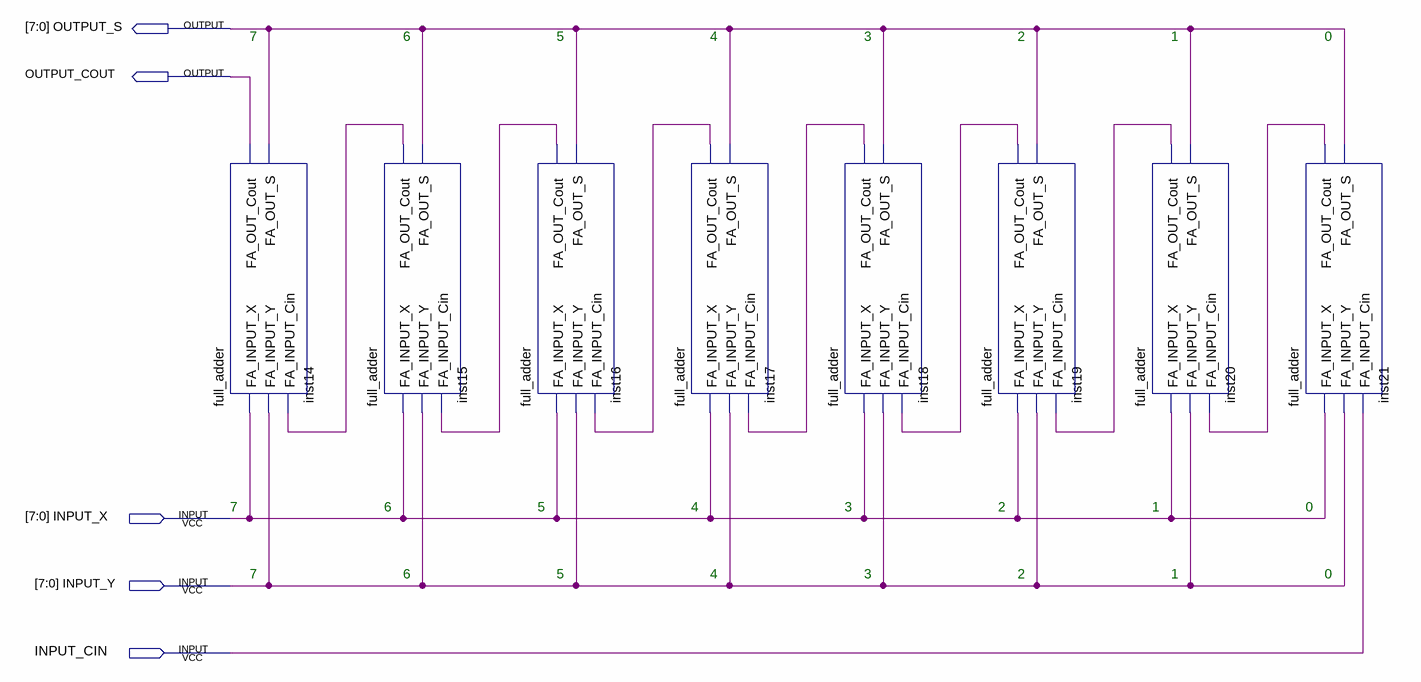
[diagram p0: schematic sheet]
// Quartus schematic rca_8b.bdf as structural Verilog: 8 symbols, 5 pins
module rca_8b (
  input  \[7..0]_INPUT_X ,
  input  \[7..0]_INPUT_Y ,
  input  INPUT_CIN,
  output \[7..0]_OUTPUT_S ,
  output OUTPUT_COUT
);

  wire inst15_fa_out_cout, inst16_fa_out_cout, inst17_fa_out_cout, inst18_fa_out_cout, inst19_fa_out_cout,
       inst20_fa_out_cout, inst21_fa_out_cout;

  full_adder inst14 (
    .FA_INPUT_X(\[7..0]_INPUT_X ), .FA_INPUT_Y(\[7..0]_INPUT_Y ), .FA_INPUT_Cin(inst15_fa_out_cout),
    .FA_OUT_Cout(OUTPUT_COUT), .FA_OUT_S(\[7..0]_OUTPUT_S ));
  full_adder inst15 (
    .FA_INPUT_X(\[7..0]_INPUT_X ), .FA_INPUT_Y(\[7..0]_INPUT_Y ), .FA_INPUT_Cin(inst16_fa_out_cout),
    .FA_OUT_Cout(inst15_fa_out_cout), .FA_OUT_S(\[7..0]_OUTPUT_S ));
  full_adder inst16 (
    .FA_INPUT_X(\[7..0]_INPUT_X ), .FA_INPUT_Y(\[7..0]_INPUT_Y ), .FA_INPUT_Cin(inst17_fa_out_cout),
    .FA_OUT_Cout(inst16_fa_out_cout), .FA_OUT_S(\[7..0]_OUTPUT_S ));
  full_adder inst17 (
    .FA_INPUT_X(\[7..0]_INPUT_X ), .FA_INPUT_Y(\[7..0]_INPUT_Y ), .FA_INPUT_Cin(inst18_fa_out_cout),
    .FA_OUT_Cout(inst17_fa_out_cout), .FA_OUT_S(\[7..0]_OUTPUT_S ));
  full_adder inst18 (
    .FA_INPUT_X(\[7..0]_INPUT_X ), .FA_INPUT_Y(\[7..0]_INPUT_Y ), .FA_INPUT_Cin(inst19_fa_out_cout),
    .FA_OUT_Cout(inst18_fa_out_cout), .FA_OUT_S(\[7..0]_OUTPUT_S ));
  full_adder inst19 (
    .FA_INPUT_X(\[7..0]_INPUT_X ), .FA_INPUT_Y(\[7..0]_INPUT_Y ), .FA_INPUT_Cin(inst20_fa_out_cout),
    .FA_OUT_Cout(inst19_fa_out_cout), .FA_OUT_S(\[7..0]_OUTPUT_S ));
  full_adder inst20 (
    .FA_INPUT_X(\[7..0]_INPUT_X ), .FA_INPUT_Y(\[7..0]_INPUT_Y ), .FA_INPUT_Cin(inst21_fa_out_cout),
    .FA_OUT_Cout(inst20_fa_out_cout), .FA_OUT_S(\[7..0]_OUTPUT_S ));
  full_adder inst21 (
    .FA_INPUT_X(\[7..0]_INPUT_X ), .FA_INPUT_Y(\[7..0]_INPUT_Y ), .FA_INPUT_Cin(INPUT_CIN),
    .FA_OUT_Cout(inst21_fa_out_cout), .FA_OUT_S(\[7..0]_OUTPUT_S ));

  // Notes on the sheet:
  //   7
  //   6
  //   5
  //   4
  //   3
  //   2
  //   1
  //   0
  //   7
  //   6
  //   5
  //   4
  //   3
  //   2
  //   1
  //   0
  //   7
  //   6
  //   5
  //   4
  //   3
  //   2
  //   1
  //   0
endmodule
